# EAGLE design Tag-ECG-1V1 (EAGLE 9.6.2)

## Sheet 1 of 2
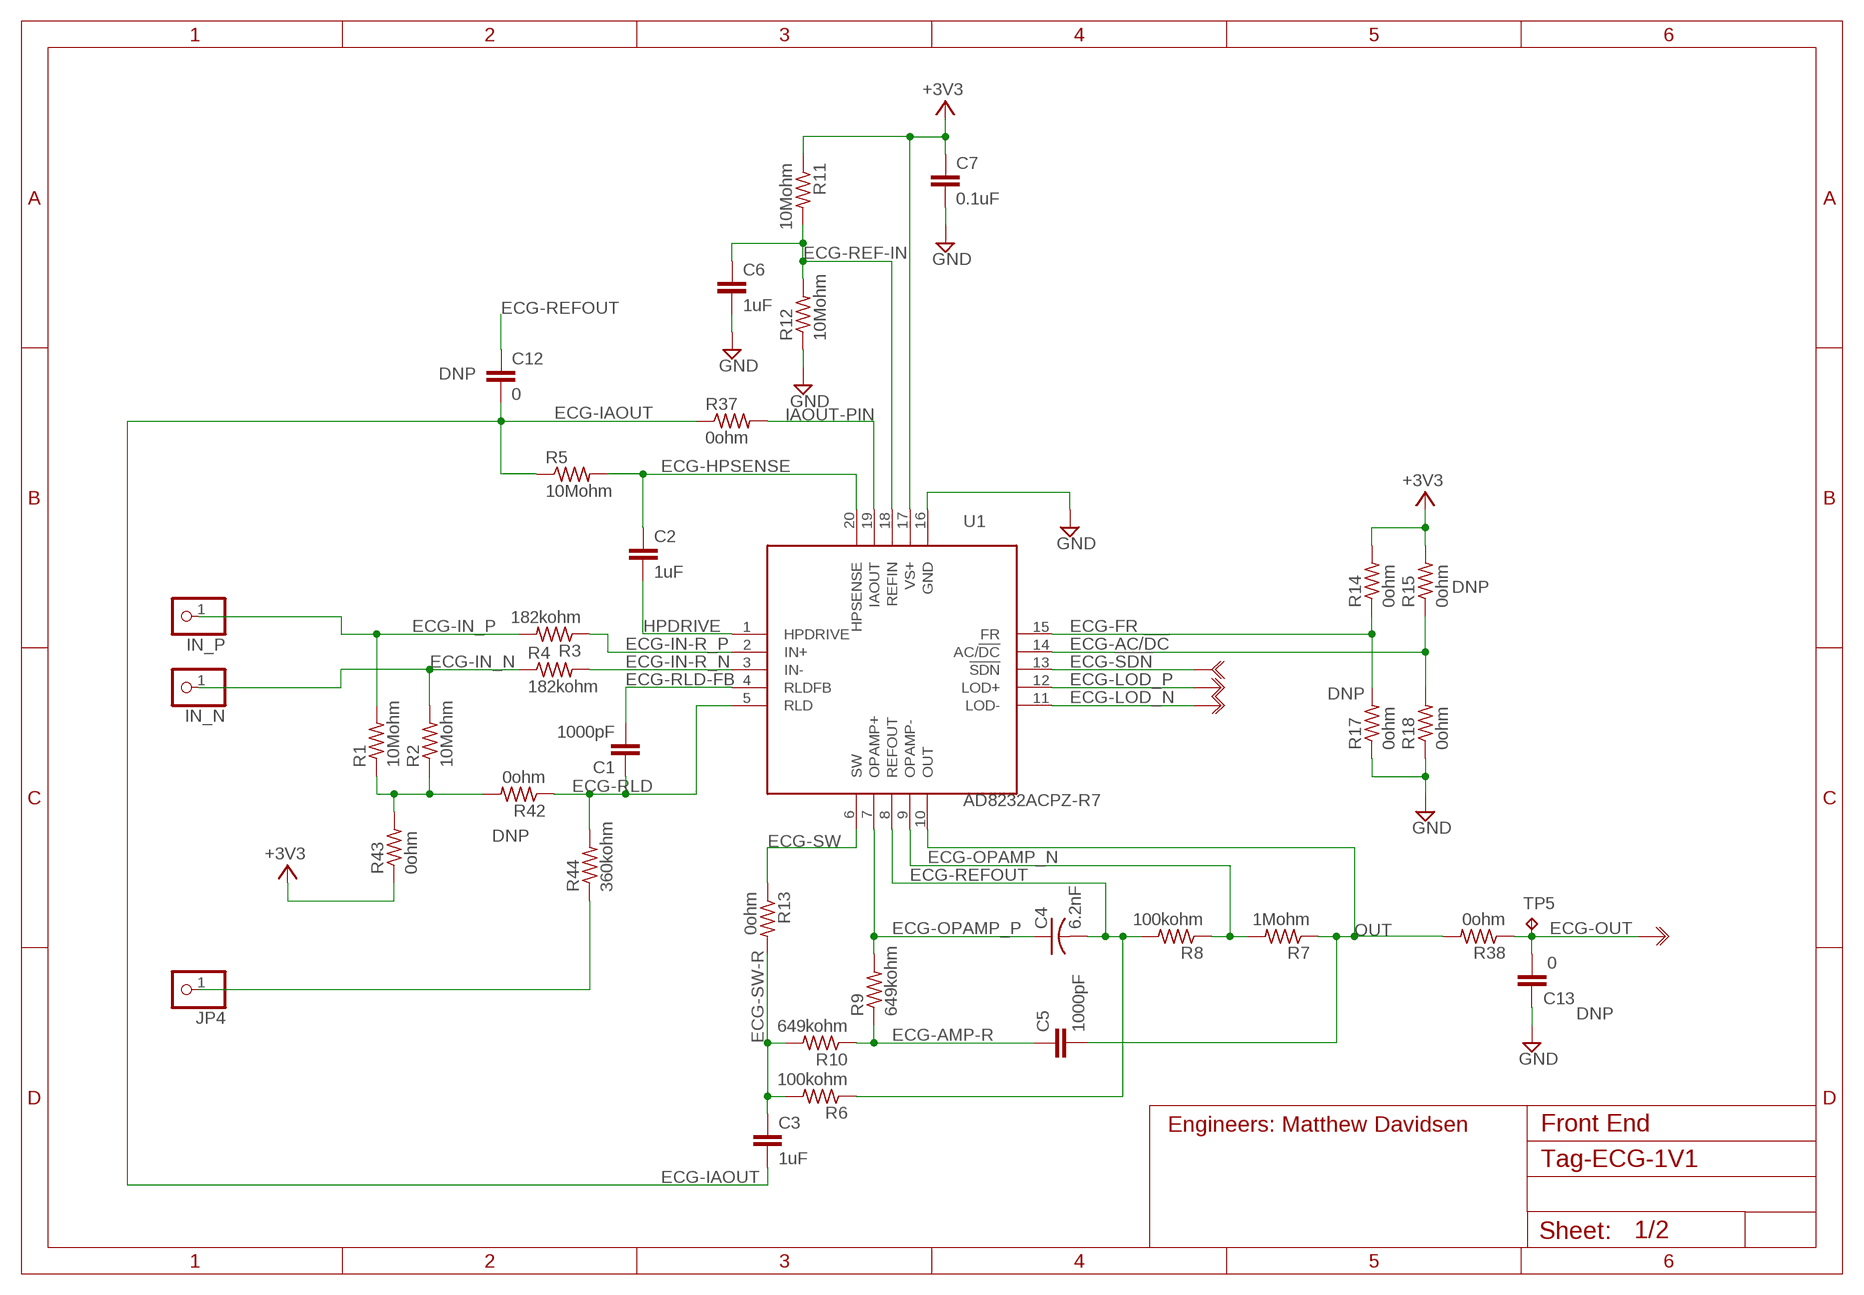
[diagram p0: schematic, sheet 1]
FRAME1 (A4L-LOC): NOTE: Engineers: Matthew Davidsen; SHEET_NAME: Front End

### Parts
C1  1000pF  CAP,CER,1000PF,2KV,10%,X7R,0402  [C0402]
C2  1uF  CAP,CER,1UF,10V,10%,X5R,0402  [C0402]
C3  1uF  CAP,CER,1UF,10V,10%,X5R,0402  [C0402]
C4  6.2nF  C-USC0603  [C0603]
C5  1000pF  CAP,CER,1000PF,2KV,10%,X7R,0402  [C0402]
C6  1uF  CAP,CER,1UF,10V,10%,X5R,0402  [C0402]
C7  0.1uF  CAP,CER,0.1UF,16V,10%,X5R,0402  [C0402]
C12  0  CAP,CER,1UF,10V,10%,X5R,0402  [C0402]
C13  0  CAP,CER,1000PF,2KV,10%,X7R,0402  [C0402]
IN_N  PINHD-1X1  [1X01]
IN_P  PINHD-1X1  [1X01]
JP4  PINHD-1X1  [1X01]
R1  10Mohm  RES,SMD,10MOHM,1%,1/10W,0402  [R0402]
R2  10Mohm  RES,SMD,10MOHM,1%,1/10W,0402  [R0402]
R3  182kohm  RES,SMD,182KOHM,1%,1/10W,0402  [R0402]
R4  182kohm  RES,SMD,182KOHM,1%,1/10W,0402  [R0402]
R5  10Mohm  RES,SMD,10MOHM,1%,1/10W,0402  [R0402]
R6  100kohm  RES,SMD,100KOHM,10%,1/10W,0402  [R0402]
R7  1Mohm  RES,SMD,1MOHM,1%,1/10W,0402  [R0402]
R8  100kohm  RES,SMD,100KOHM,10%,1/10W,0402  [R0402]
R9  649kohm  RES,SMD,649KOHM,1%,1/10W,0402  [R0402]
R10  649kohm  RES,SMD,649KOHM,1%,1/10W,0402  [R0402]
R11  10Mohm  RES,SMD,10MOHM,1%,1/10W,0402  [R0402]
R12  10Mohm  RES,SMD,10MOHM,1%,1/10W,0402  [R0402]
R13  0ohm  RES,SMD,1MOHM,1%,1/10W,0402  [R0402]
R14  0ohm  RES,SMD,0OHM,5%,1/16W,0402  [R0402]
R15  0ohm  RES,SMD,0OHM,5%,1/16W,0402  [R0402]
R17  0ohm  RES,SMD,0OHM,5%,1/16W,0402  [R0402]
R18  0ohm  RES,SMD,0OHM,5%,1/16W,0402  [R0402]
R37  0ohm  RES,SMD,10MOHM,1%,1/10W,0402  [R0402]
R38  0ohm  RES,SMD,1MOHM,1%,1/10W,0402  [R0402]
R42  0ohm  RES,SMD,0OHM,5%,1/16W,0402  [R0402]
R43  0ohm  RES,SMD,0OHM,5%,1/16W,0402  [R0402]
R44  360kohm  RES,SMD,0OHM,5%,1/16W,0402  [R0402]
TP5  TPB1,27  [B1,27]
U1  AD8232ACPZ-R7  [AD8232ACPZ-R7]
U$2  ON-PAGE  (no package)
U$5  OFF-PAGE  (no package)
U$6  OFF-PAGE  (no package)
U$39  OFF-PAGE  (no package)

### Nets
+3V3: C7.1 R11.1 R14.2 R15.2 R43.1 U1.17(VS+) ; also sheet 2
ECG-!SDN: U1.13(!SDN) U$2.IN ; also sheet 2
ECG-AC/!DC: R15.1 R18.2 U1.14(AC/!DC)
ECG-AMP-R: C5.1 R9.1 R10.1
ECG-FR: R14.1 R17.2 U1.15(FR)
ECG-HPSENSE: C2.1 R5.2 U1.20(HPSENSE)
ECG-IAOUT: C3.2 C12.2 R5.1 R37.1 ; also sheet 2
ECG-IN-R_N: R4.2 U1.3(IN-)
ECG-IN-R_P: R3.1 U1.2(IN+)
ECG-IN_N: IN_N.1 R2.2 R4.1 ; also sheet 2
ECG-IN_P: IN_P.1 R1.2 R3.2 ; also sheet 2
ECG-LOD_N: U1.11(LOD-) U$39.OUT ; also sheet 2
ECG-LOD_P: U1.12(LOD+) U$6.OUT ; also sheet 2
ECG-OPAMP_N: R7.2 R8.1 U1.9(OPAMP-)
ECG-OPAMP_P: C4.1 R9.2 U1.7(OPAMP+)
ECG-OUT: C13.2 R38.1 TP5.TP U$5.OUT ; also sheet 2
ECG-REF-IN: C6.1 R11.2 R12.2 U1.18(REFIN)
ECG-REFOUT: C4.2 C12.1 R6.1 R8.2 U1.8(REFOUT)
ECG-RLD: C1.1 R42.1 R44.2 U1.5(RLD) ; also sheet 2
ECG-RLD-FB: C1.2 U1.4(RLDFB)
ECG-SW: R13.1 U1.6(SW)
ECG-SW-R: C3.1 R6.2 R10.2 R13.2
GND: C6.2 C7.2 C13.1 R12.1 R17.1 R18.1 U1.16(GND) ; also sheet 2
HPDRIVE: C2.2 U1.1(HPDRIVE)
IAOUT-PIN: R37.2 U1.19(IAOUT)
N$2: R1.1 R2.1 R42.2 R43.2
N$4: JP4.1 R44.1
OUT: C5.2 R7.1 R38.2 U1.10(OUT)

### Notes on the sheet
- DNP
- DNP
- DNP
- DNP
- DNP

## Sheet 2 of 2
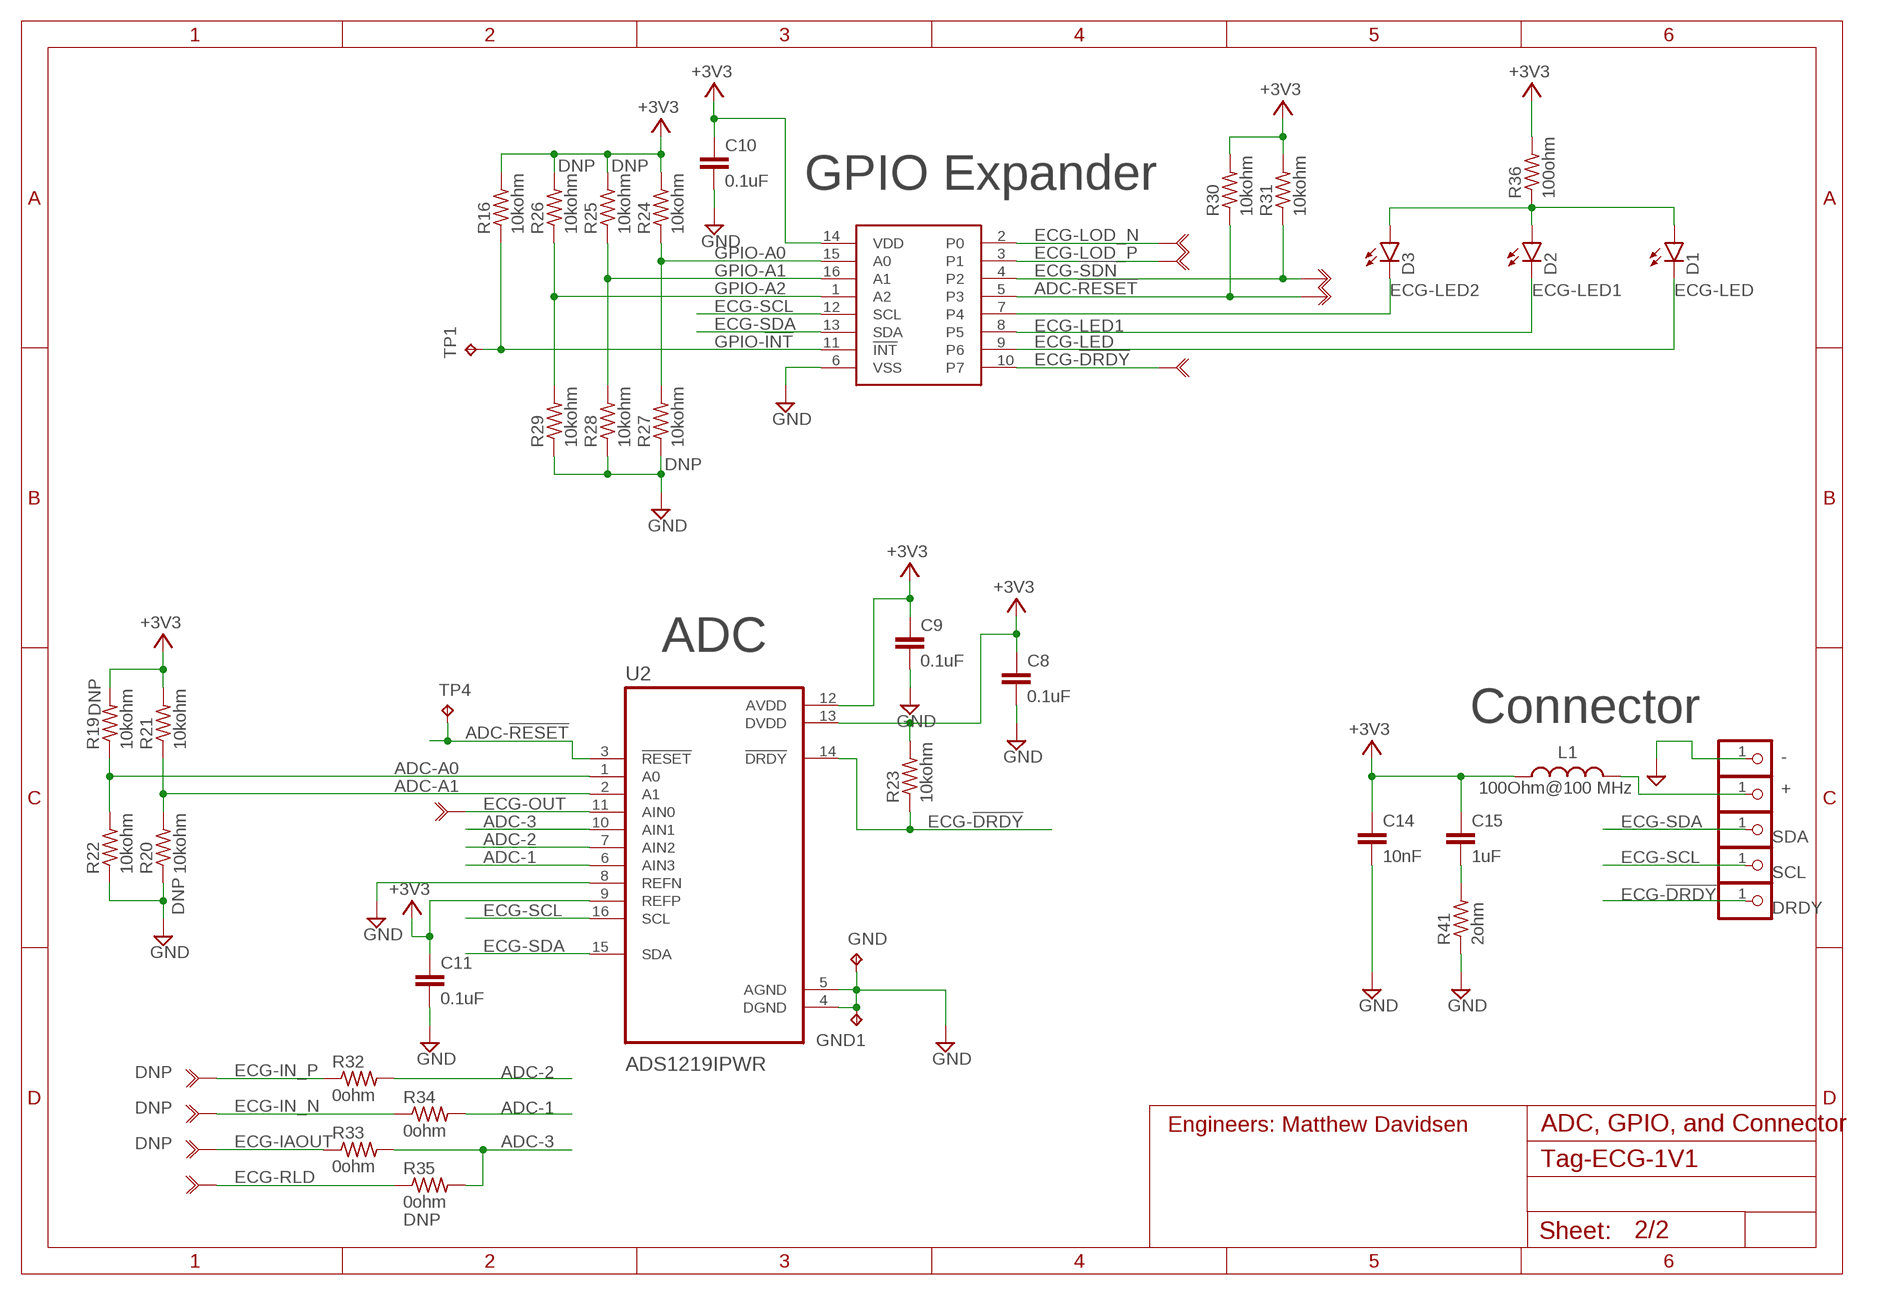
[diagram p1: schematic, sheet 2]
FRAME2 (A4L-LOC): NOTE: Engineers: Matthew Davidsen; SHEET_NAME: ADC, GPIO, and Connector

### Parts
+  PINHD-1X1  [1X01]
-  PINHD-1X1  [1X01]
C8  0.1uF  CAP,CER,0.1UF,16V,10%,X5R,0402  [C0402]
C9  0.1uF  CAP,CER,0.1UF,16V,10%,X5R,0402  [C0402]
C10  0.1uF  CAP,CER,0.1UF,16V,10%,X5R,0402  [C0402]
C11  0.1uF  CAP,CER,0.1UF,16V,10%,X5R,0402  [C0402]
C14  10nF  CAP,CER,0.1UF,16V,10%,X5R,0402  [C0402]
C15  1uF  CAP,CER,0.1UF,16V,10%,X5R,0402  [C0402]
D1  LED,SMD,GREEN,0603CHIP-LED0603  [CHIP-LED0603]
D2  LED,SMD,GREEN,0603CHIP-LED0603  [CHIP-LED0603]
D3  LED,SMD,GREEN,0603CHIP-LED0603  [CHIP-LED0603]
DRDY  PINHD-1X1  [1X01]
GND  TPB1,27  [B1,27]
GND1  TPB1,27  [B1,27]
L1  100Ohm@100 MHz  WE-CBF_0402_742792711_WB_HS  [WE-CBF_0402_W1.5]
R16  10kohm  RES,SMD,10KOHM,1%,1/16W,0402  [R0402]
R19  10kohm  RES,SMD,10KOHM,1%,1/16W,0402  [R0402]
R20  10kohm  RES,SMD,10KOHM,1%,1/16W,0402  [R0402]
R21  10kohm  RES,SMD,10KOHM,1%,1/16W,0402  [R0402]
R22  10kohm  RES,SMD,10KOHM,1%,1/16W,0402  [R0402]
R23  10kohm  RES,SMD,10KOHM,1%,1/16W,0402  [R0402]
R24  10kohm  RES,SMD,10KOHM,1%,1/16W,0402  [R0402]
R25  10kohm  RES,SMD,10KOHM,1%,1/16W,0402  [R0402]
R26  10kohm  RES,SMD,10KOHM,1%,1/16W,0402  [R0402]
R27  10kohm  RES,SMD,10KOHM,1%,1/16W,0402  [R0402]
R28  10kohm  RES,SMD,10KOHM,1%,1/16W,0402  [R0402]
R29  10kohm  RES,SMD,10KOHM,1%,1/16W,0402  [R0402]
R30  10kohm  RES,SMD,10KOHM,1%,1/16W,0402  [R0402]
R31  10kohm  RES,SMD,10KOHM,1%,1/16W,0402  [R0402]
R32  0ohm  RES,SMD,0OHM,5%,1/16W,0402  [R0402]
R33  0ohm  RES,SMD,0OHM,5%,1/16W,0402  [R0402]
R34  0ohm  RES,SMD,0OHM,5%,1/16W,0402  [R0402]
R35  0ohm  RES,SMD,0OHM,5%,1/16W,0402  [R0402]
R36  100ohm  RES,SMD,100OHM,5%,1/10W,0402  [R0402]
R41  2ohm  RES,SMD,10KOHM,1%,1/16W,0402  [R0402]
SCL  PINHD-1X1  [1X01]
SDA  PINHD-1X1  [1X01]
TP1  TPB1,27  [B1,27]
TP4  TPB1,27  [B1,27]
U2  ADS1219IPWR  [SOP65P640X120-16N]
U3  PCA9674ABS  [QFN3X3-6]
U$1  ON-PAGE  (no package)
U$3  ON-PAGE  (no package)
U$4  ON-PAGE  (no package)
U$7  OFF-PAGE  (no package)
U$21  ON-PAGE  (no package)
U$22  ON-PAGE  (no package)
U$24  ON-PAGE  (no package)
U$25  ON-PAGE  (no package)
U$35  OFF-PAGE  (no package)
U$40  ON-PAGE  (no package)

### Nets
+3V3: C8.1 C9.1 C10.1 C11.1 C14.1 C15.1 L1.1 R16.2 R19.2 R21.2 R23.2 R24.2 R25.2 R26.2 R30.2 R31.2 R36.2 U2.9(REFP) U2.12(AVDD) U2.13(DVDD) U3.14(VDD) ; also sheet 1
ADC-1: R34.2 U2.6(AIN3)
ADC-2: R32.2 U2.7(AIN2)
ADC-3: R33.2 R35.2 U2.10(AIN1)
ADC-!RESET: R30.1 TP4.TP U2.3(!RESET) U3.5(P3) U$7.OUT
ADC-A0: R19.1 R22.2 U2.1(A0)
ADC-A1: R20.2 R21.1 U2.2(A1)
ECG-!DRDY: DRDY.1 R23.1 U2.14(!DRDY) U3.10(P7) U$40.IN
ECG-!SDN: R31.1 U3.4(P2) U$35.OUT ; also sheet 1
ECG-IAOUT: R33.1 U$24.IN ; also sheet 1
ECG-IN_N: R34.1 U$25.IN ; also sheet 1
ECG-IN_P: R32.1 U$4.IN ; also sheet 1
ECG-LED: D1.C U3.9(P6)
ECG-LED1: D2.C U3.8(P5)
ECG-LED2: D3.C U3.7(P4)
ECG-LOD_N: U3.2(P0) U$1.IN ; also sheet 1
ECG-LOD_P: U3.3(P1) U$22.IN ; also sheet 1
ECG-OUT: U2.11(AIN0) U$21.IN ; also sheet 1
ECG-RLD: R35.1 U$3.IN ; also sheet 1
ECG-SCL: SCL.1 U2.16(SCL) U3.12(SCL)
ECG-SDA: SDA.1 U2.15(SDA) U3.13(SDA)
GND: -.1 C8.2 C9.2 C10.2 C11.2 C14.2 GND1.TP GND.TP R20.1 R22.1 R27.1 R28.1 R29.1 R41.1 U2.4(DGND) U2.5(AGND) U2.8(REFN) U3.6(VSS) ; also sheet 1
GPIO-!INT: R16.1 TP1.TP U3.11(!INT)
GPIO-A0: R24.1 R27.2 U3.15(A0)
GPIO-A1: R25.1 R28.2 U3.16(A1)
GPIO-A2: R26.1 R29.2 U3.1(A2)
N$1: +.1 L1.2
N$3: C15.2 R41.2
N$7: D1.A D2.A D3.A R36.1

### Notes on the sheet
- DNP | DNP
- GPIO Expander
- DNP
- ADC
- DNP
- Connector
- DNP
- DNP
- DNP
- DNP
- DNP

## Library data of the parts
+ - DRDY IN_N IN_P JP4 SCL SDA = pinhead:PINHD-1X1: PIN HEADER
C1 C5 = 0-Standard-Passives:CAP,CER,1000PF,2KV,10%,X7R,0402
C2 C3 C6 = 0-Standard-Passives:CAP,CER,1UF,10V,10%,X5R,0402
C4 = rcl:C-US: CAPACITOR, American symbol; SPICEPREFIX: C
C7-C11 = 0-Standard-Passives:CAP,CER,0.1UF,16V,10%,X5R,0402
C12 = 0-Standard-Passives:CAP,CER,1UF,10V,10%,X5R,0402; VALUE: 1uF
C13 = 0-Standard-Passives:CAP,CER,1000PF,2KV,10%,X7R,0402; VALUE: 1000pF
C14 C15 = 0-Standard-Passives:CAP,CER,0.1UF,16V,10%,X5R,0402; VALUE: 0.1uF
D1-D3 = 0-Custom-Opto:LED,SMD,GREEN,0603
GND GND1 TP1 TP4 TP5 = testpad:TP: Test pad
L1 = Wurth_EMC Components_WE-CBF:WE-CBF_0402: WE-CBF SMD EMI Suppression Ferrite Bead Characteristics Reliable Ni-Sn electrodes High rated current up to 6 A Operating temperature: –55 ºC to +125 ºC Applications Perfect as data lined filter and for uncoupling of distribution voltage Package name and Variant abbreviation: Package: Wide Band /High Speed: W=Width= 1.5 High Current: W=Width= 2.2 Variant abbreviation: WB = Wide Band HS=High Speed HC=High Current <https://www.we-online.com/catalog/media/o14753v209%20Family_WE-CBF.jpg> Details see: www.we-online.com/katalog/WE-CBF <www.we-online.com/catalog/WE-CBF/?utm_source=eagle_model&utm_medium=description_link&utm_campaign=eisos_eagle> Updated by Ella Wu 2022-11-02 2022(C) Wurth Elektronik; DATASHEET-URL: https://www.we-online.com/redexpert/spec/742792711?ae; IR2: 870mA; MOUNT: SMT; PART-NUMBER: 742792711; RDC-MAX: 0.3Ohm; TYPE: High Speed; Z-MAX: 200Ohm@800 MHz
R1 R2 R5 R11 R12 = 0-Standard-Passives:RES,SMD,10MOHM,1%,1/10W,0402
R3 R4 = 0-Standard-Passives:RES,SMD,182KOHM,1%,1/10W,0402
R6 R8 = 0-Standard-Passives:RES,SMD,100KOHM,10%,1/10W,0402
R7 = 0-Standard-Passives:RES,SMD,1MOHM,1%,1/10W,0402
R9 R10 = 0-Standard-Passives:RES,SMD,649KOHM,1%,1/10W,0402
R13 R38 = 0-Standard-Passives:RES,SMD,1MOHM,1%,1/10W,0402; VALUE: 1Mohm
R14 R15 R17 R18 R32-R35 R42 R43 = 0-Standard-Passives:RES,SMD,0OHM,5%,1/16W,0402
R16 R19-R31 = 0-Standard-Passives:RES,SMD,10KOHM,1%,1/16W,0402
R36 = 0-Standard-Passives:RES,SMD,100OHM,5%,1/10W,0402
R37 = 0-Standard-Passives:RES,SMD,10MOHM,1%,1/10W,0402; VALUE: 10Mohm
R41 = 0-Standard-Passives:RES,SMD,10KOHM,1%,1/16W,0402; VALUE: 10kohm
R44 = 0-Standard-Passives:RES,SMD,0OHM,5%,1/16W,0402; VALUE: 0ohm
U1 = AD8232ACPZ-R7:AD8232ACPZ-R7
U2 = ADS1219IPWR:ADS1219IPWR; DESCRIPTION: 24-bit, 1kSPS, 4-ch general-purpose delta-sigma ADC with I2C interface and external Vref inputs; DIGI-KEY_PART_NUMBER: 296-50884-2-ND; MF: Texas Instruments; MP: ADS1219IPWR; PACKAGE: TSSOP-16 Texas Instruments; PURCHASE-URL: https://pricing.snapeda.com/search/part/ADS1219IPWR/?ref=eda
U3 = untitled:PCA9674ABS
U$1-U$4 U$21 U$22 U$24 U$25 U$40 = 0-Custom-Markers:ON-PAGE
U$5-U$7 U$35 U$39 = 0-Custom-Markers:OFF-PAGE

## Board
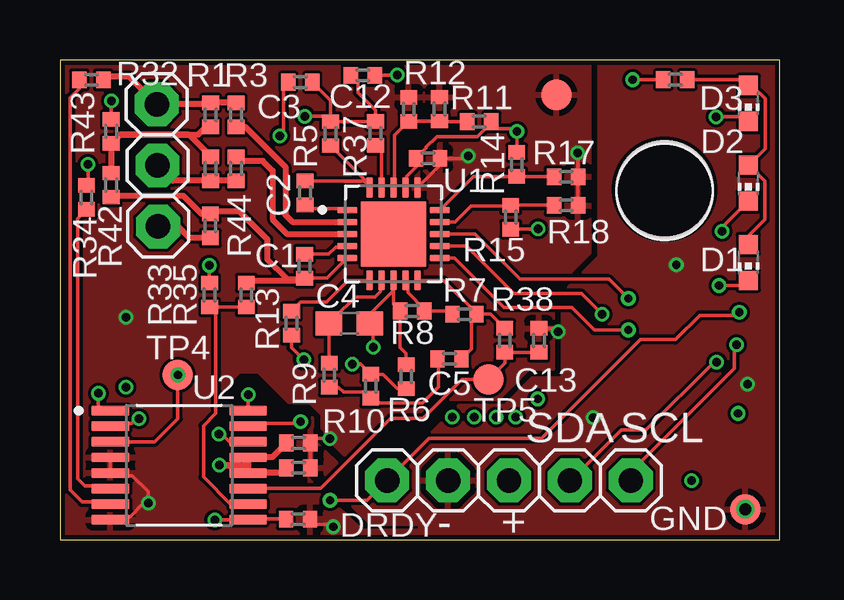
[diagram p2: board, top side]
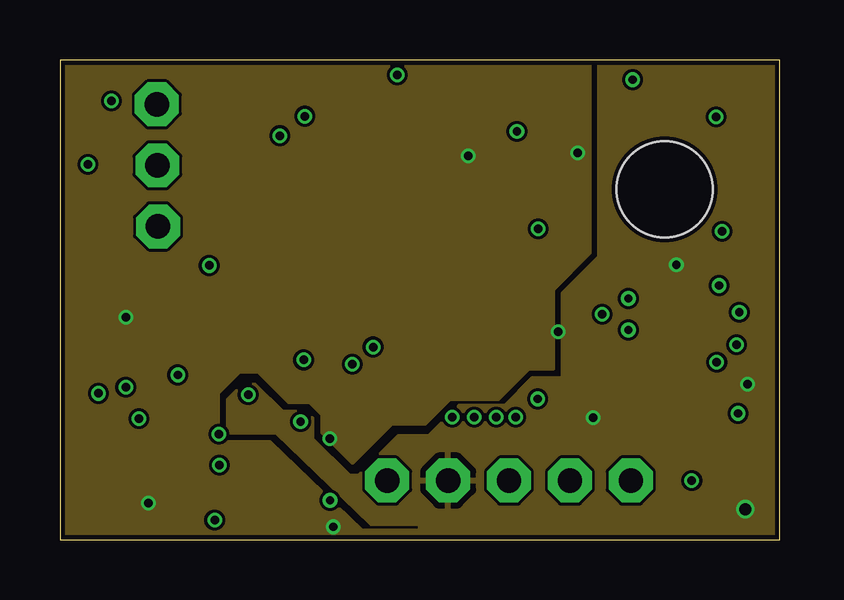
[diagram p3: board, inner layer Route2]
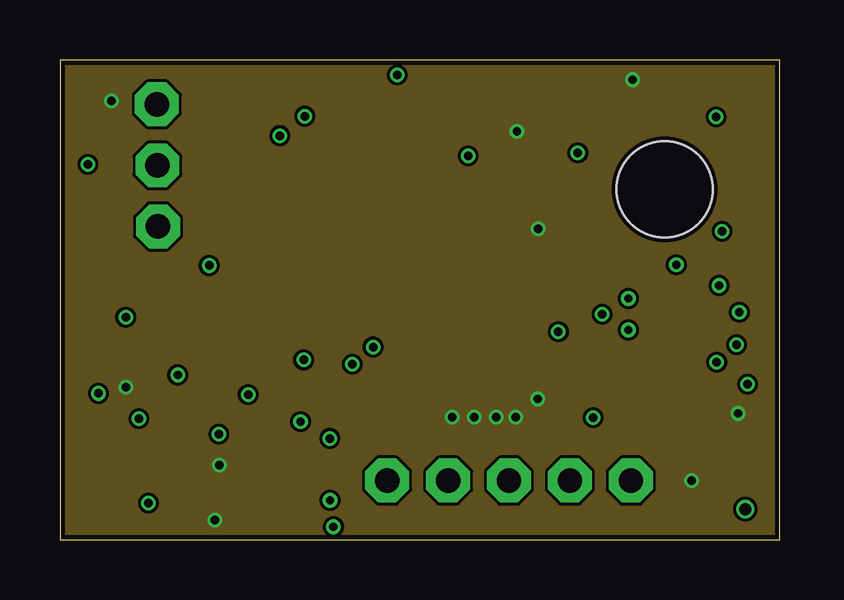
[diagram p4: board, inner layer Route15]
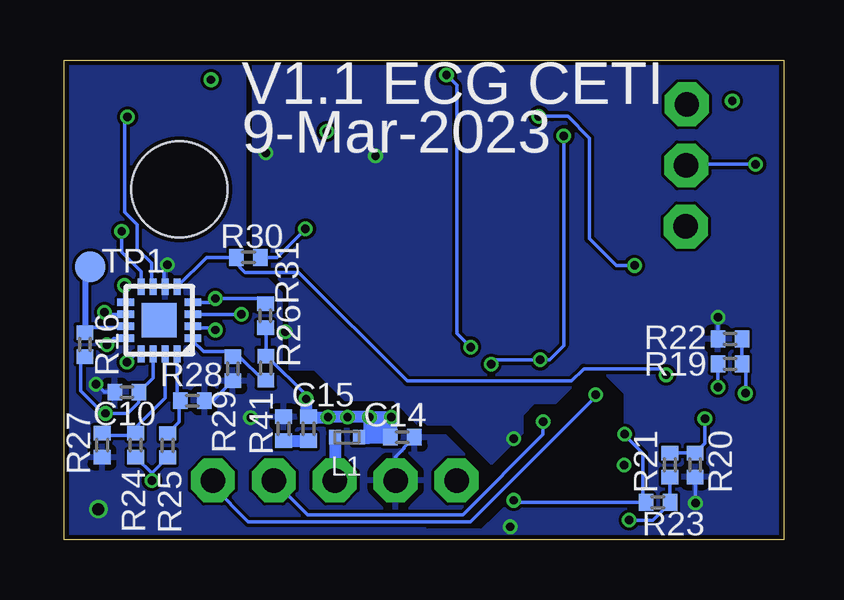
[diagram p5: board, bottom side, seen from below]

Size 30 x 20 mm. Coordinates in mm from the lower left corner, seen from the top.
Outline: 0,0 30,0 30,20 0,20 0,0
Copper layers (1+2*15+16): Top 0.035mm / dielectric 0.2mm / Route2 0.0175mm / dielectric 1.065mm / Route15 0.0175mm / dielectric 0.2mm / Bottom 0.035mm
Design rules "default *": minimum track width 3.5mil, minimum drill 0.3mm, track to track 5mil, track to pad 0.2mm, pad to pad 5mil, via to via 0.5mm, smd to smd 5mil, copper to edge 0.2mm, drill to drill 6mil, minimum pad ring 10mil, minimum via ring 0.13mm, stop-mask expansion 0.05mm, vias tented up to drill 20mil, thermal gap 10mil
Holes 4 mm at 25.2,14.6

### Footprints (pad centres in the part's own frame; a part is rotated, then mirrored left to right if it is on the bottom)
1X01 = drill 1.016 octagon: 1 0,0
C0402 = smd 0.6 x 0.7: 1 -0.5,0; 2 0.5,0
C0603 = smd 1.1 x 1: 1 -0.85,0; 2 0.85,0
CHIP-LED0603 = smd 0.8 x 0.8: A 0,-0.75; C 0,0.75
B1,27 = smd 1.27 x 1.27: TP 0,0
WE-CBF_0402_W1.5 = smd 0.5 x 0.6: 1 -0.5,0; 2 0.5,0
R0402 = smd 0.6 x 0.7: 1 -0.5,0; 2 0.5,0
AD8232ACPZ-R7 = smd 0.84 x 0.26: 1 -1.935,1; 2 -1.935,0.5; 3 -1.935,0; 4 -1.935,-0.5; 5 -1.935,-1; 11 1.935,-1; 12 1.935,-0.5; 13 1.935,0; 14 1.935,0.5; 15 1.935,1 | smd 0.26 x 0.84: 6 -1,-1.935; 7 -0.5,-1.935; 8 0,-1.935; 9 0.5,-1.935; 10 1,-1.935; 16 1,1.935; 17 0.5,1.935; 18 0,1.935; 19 -0.5,1.935; 20 -1,1.935 | smd 2.7 x 2.7: 21 0,0
SOP65P640X120-16N = smd 1.57 x 0.41: 1 -2.87,2.275; 2 -2.87,1.625; 3 -2.87,0.975; 4 -2.87,0.325; 5 -2.87,-0.325; 6 -2.87,-0.975; 7 -2.87,-1.625; 8 -2.87,-2.275; 9 2.87,-2.275; 10 2.87,-1.625; 11 2.87,-0.975; 12 2.87,-0.325; 13 2.87,0.325; 14 2.87,0.975; 15 2.87,1.625; 16 2.87,2.275
QFN3X3-6 = smd 0.7 x 0.3: 1 -1.4,0.75; 2 -1.4,0.25; 3 -1.4,-0.25; 4 -1.4,-0.75; 9 1.4,-0.75; 10 1.4,-0.25; 11 1.4,0.25; 12 1.4,0.75 | smd 0.3 x 0.7: 5 -0.75,-1.4; 6 -0.25,-1.4; 7 0.25,-1.4; 8 0.75,-1.4; 13 0.75,1.4; 14 0.25,1.4; 15 -0.25,1.4; 16 -0.75,1.4 | smd 1.45 x 1.45: EXP 0,0

### Placement (x,y rotation side)
+  18.72,2.46 0 top
-  16.18,2.46 0 top
C1  10.2,11.4 90 top
C2  10.22,14.46 270 top
C3  10.02,19.07 0 top
C4  12.06,9.02 0 top
C5  16.24,7.54 0 top
C6  14.54,17.94 90 top
C7  15.34,15.89 0 top
C8  9.94,3 0 top
C9  9.94,4.03 0 top
C10  27.39,6.15 180 bottom
C11  9.93,0.86 0 top
C12  12.62,19.35 180 top
C13  19.96,8.31 270 top
C14  15.9,4.27 0 bottom
C15  19.81,4.62 270 bottom
D1  28.7,11.56 180 top
D2  28.7,14.86 180 top
D3  28.7,18.19 180 top
DRDY  13.64,2.46 0 top
GND  28.57,1.27 0 top
GND1  20.7,18.54 0 top
IN_N  4.06,15.61 0 top
IN_P  4.04,18.15 0 top
JP4  4.09,13.06 0 top
L1  18.21,4.27 180 bottom
R1  6.28,17.71 90 top
R2  6.28,15.46 270 top
R3  7.35,17.71 90 top
R4  7.34,15.46 90 top
R5  11.29,16.93 270 top
R6  14.44,6.8 270 top
R7  16.86,9.4 180 top
R8  14.68,9.53 180 top
R9  11.23,6.85 90 top
R10  12.96,6.39 90 top
R11  17.48,17.43 180 top
R12  15.82,17.95 270 top
R13  9.65,9.02 270 top
R14  19.04,15.64 90 top
R15  18.79,13.44 270 top
R16  29.13,8.13 270 bottom
R17  21.1,15.13 180 top
R18  21.1,13.93 180 top
R19  2.24,7.33 180 bottom
R20  3.7,3.11 90 bottom
R21  4.75,3.11 270 bottom
R22  2.24,8.36 0 bottom
R23  5.25,1.55 0 bottom
R24  27.02,3.94 270 bottom
R25  25.68,3.93 270 bottom
R26  21.59,7.15 90 bottom
R27  28.42,3.94 90 bottom
R28  24.65,5.79 180 bottom
R29  22.97,7.12 90 bottom
R30  22.31,11.77 0 bottom
R31  21.61,9.33 270 bottom
R32  1.31,19.17 180 top
R33  6.24,10.2 270 top
R34  1.11,14.26 270 top
R35  7.77,10.2 270 top
R36  25.65,19.18 180 top
R37  13.16,16.94 270 top
R38  18.54,8.31 90 top
R41  20.85,4.62 270 bottom
R42  2.13,14.78 90 top
R43  2.13,17.02 270 top
R44  6.27,13.08 90 top
SCL  23.8,2.46 0 top
SDA  21.26,2.46 0 top
TP1  28.91,11.38 180 bottom
TP4  4.91,6.86 180 top
TP5  17.86,6.68 0 top
U1  13.91,12.74 0 top
U2  4.97,3.1 0 top
U3  26.04,9.14 180 bottom

### Tracks (layer width: path | path; a pad name or v marks a point on that pad's centre or on a via)
+3V3  (via drill 0.35)
  Top 0.152: U1.17 14.45,14.72 14.45,15.14 14.84,15.54 C7.1 15.27,16.32 15.27,16.36 15.71,16.8 17.4,16.8 17.92,17.32 18.09,17.32 | v6.45,0.81 6.47,0.83 U2.9 7.87,0.86 C11.1 | R36.2 v23.88,19.18 | R14.2 v19.04,17.01 v19.05,17.02 18.92,17.14 18.27,17.14 18.09,17.32 | R11.1 18.09,17.32 | R15.2 v19.93,12.95 v19.94,12.95 | R43.1 2.14,17.53 v2.14,18.29
  Top 0.254: C8.1 9.23,2.78 U2.12 | C9.1 8.84,3.43 U2.13 | U2.13 U2.12 | U2.12 7.51,3.1 v6.65,3.1 7.64,3.1 7.84,3.3 U2.13
  Bottom 0.152: U3.14 26.29,6.75 C10.1 26.89,5.72 27.35,5.27 v28.27,5.27 v28.27,5.26 28.38,5.26 29.31,6.19 29.31,7.45 R16.2 | v6.45,0.81 5.45,0.81 4.92,1.34 4.92,1.39 R23.2 | R23.2 | R21.2 R23.2 | R25.2 26.34,2.77 v26.34,2.46 26.34,2.76 R24.2 | 19.8,5.11 C15.1 | v2.74,6.35 R19.2 | R30.2 21.13,11.77 v19.94,12.95 | 17.32,4.23 17.27,4.28 | v19.91,5.87 19.91,6.03 21.49,7.6 21.54,7.6 R26.2 21.59,8.81 R31.2
  Bottom 0.508: 17.27,4.28 v17.27,5.11 | 17.32,4.23 16.43,4.23 C14.1 16.36,4.31 v16.36,5.11 | v19.91,5.87 19.91,5.22 C15.1 19.79,5.1 19.01,5.1 v19,5.11 v18.19,5.11 v17.27,5.11 | v17.27,5.11 v16.36,5.11 | v16.36,5.11 16.48,5.11 17.36,4.23 17.68,4.23 L1.1 | v17.27,5.11 16.4,4.23
  pour Route15: 0,20 0,0 30,0 30,20
ADC-1
  Top 0.152: U2.6 2,2.23 1.03,2.23 0.73,2.52 0.73,13.39 R34.2
ADC-2
  Top 0.152: U2.7 2.01,1.57 0.93,1.57 0.43,2.06 0.43,18.42 0.81,18.8 R32.2
ADC-3
  Top 0.152: U2.10 7.12,1.48 5.99,2.61 5.99,4.75 6.5,5.25 6.5,9.44 R33.2 R35.2
ADC-!RESET  (via drill 0.35)
  Top 0.152: U2.3 3.95,4.08 4.91,5.04 TP4.TP
  Bottom 0.152: U3.5 24.06,11.77 R30.1 22.94,11.64 22.94,11.63 22.45,11.14 20.22,11.14 15.69,6.61 8.85,6.61 8.34,7.12 5.16,7.12 TP4.TP
  other vias: 4.91,6.86
ADC-A0  (via drill 0.35)
  Top 0.152: v1.6,6.1 1.6,5.6 1.87,5.33 2.05,5.33 U2.1
  Bottom 0.152: v1.6,6.1 1.59,6.11 1.59,7.17 R19.1 R22.2
ADC-A1  (via drill 0.35)
  Top 0.152: U2.2 2.22,4.85 2.99,4.85 3.19,5.04 v3.29,5.04
  Bottom 0.152: R21.1 R20.2 3.29,4.02 v3.29,5.04
ECG-!DRDY  (via drill 0.35)
  Top 0.152: U2.14 7.08,4.08 6.82,4.33 6.69,4.33 v6.63,4.39 | v11.26,1.63 12.81,1.63 DRDY.1 15.39,4.22 20.07,4.22 24.19,8.34 25.65,8.34 26.67,9.35 28.19,9.35 v28.32,9.48
  Bottom 0.152: v6.63,4.39 6.63,4.34 5.87,3.59 5.87,1.68 R23.1 11.18,1.55 v11.26,1.63 | U3.10 28.24,9.39 v28.32,9.48
ECG-!SDN  (via drill 0.35)
  Top 0.152: v23.7,10.05 22.89,10.86 19.18,10.86 17.3,12.74 U1.13
  Bottom 0.152: U3.4 23.86,9.89 v23.7,10.05 21.83,10.05 R31.1
ECG-AC/!DC
  Top 0.152: U1.14 16.47,13.24 17.14,13.91 18.76,13.91 R15.1 20.59,13.95 R18.2
ECG-AMP-R
  Top 0.152: R9.1 11.61,6.35 11.82,6.15 12.71,6.15 R10.1 13.16,5.69 15.12,5.69 15.79,6.36 15.79,7.49 C5.1
ECG-FR
  Top 0.152: U1.15 17.24,15.14 R14.1 19.06,15.13 R17.2
ECG-HPSENSE
  Top 0.152: R5.2 12.91,14.81 12.91,14.73 | 12.91,14.73 U1.20 | C2.1 12.68,14.96 12.91,14.73
ECG-IAOUT  (via drill 0.35)
  Top 0.152: R5.1 11.29,18.31 C3.2 | C12.2 12.42,19.06 12.42,18.64 13.16,17.9 R37.1 13.14,17.43 R5.1 | R33.1 6.22,10.72 v6.22,11.43 | v10.21,17.65 11.06,17.65 R5.1
  Bottom 0.152: v6.22,11.43 6.99,11.43 8.1,12.55 8.1,16.75 9.01,17.65 9.66,17.65 | 9.66,17.65 | 9.66,17.65 v10.21,17.65
ECG-IN-R_N
  Top 0.254: U1.3 9.47,12.74 8.87,13.35 8.87,15.37 8.45,15.79 7.52,15.79 R4.2
ECG-IN-R_P
  Top 0.254: R3.1 7.73,17.21 9.4,15.54 9.4,13.54 9.69,13.24 U1.2
ECG-IN_N  (via drill 0.35)
  Top 0.152: v1.17,15.65 1.17,14.76 R34.1 | R2.2
  Top 0.254: IN_N.1 4.71,14.96 R2.2 R4.1
  Bottom 0.152: IN_N.1 4.02,15.65 v1.17,15.65
ECG-IN_P
  Top 0.254: R3.2 R1.2 6.23,18.16 IN_P.1 2.89,19.3 1.94,19.3 R32.1
ECG-LED  (via drill 0.35)
  Top 0.152: D1.C 28.49,10.59 v27.48,10.59
  Bottom 0.152: U3.9 27.48,9.94 v27.48,10.59
ECG-LED1  (via drill 0.35)
  Top 0.152: D2.C 27.6,13.01 v27.6,12.85
  Bottom 0.152: U3.8 26.79,11.18 27.6,11.99 v27.6,12.85
ECG-LED2  (via drill 0.35)
  Top 0.152: D3.C 28.51,17.63 v27.36,17.63
  Bottom 0.152: U3.7 26.36,10.62 26.36,11.52 26.95,12.11 26.95,13.13 27.48,13.66 27.48,17.5 v27.36,17.63
ECG-LOD_N  (via drill 0.35)
  Top 0.152: v23.7,8.74 22.28,8.74 21.34,9.68 18.52,9.68 16.45,11.74 U1.11
  Bottom 0.152: U3.2 24.56,8.82 23.84,8.82 23.76,8.74 v23.7,8.74
ECG-LOD_P  (via drill 0.35)
  Top 0.152: U1.12 16.94,12.24 18.92,10.26 21.74,10.26 v22.61,9.4 v22.61,9.39
  Bottom 0.152: U3.3 v22.61,9.39
ECG-OPAMP_N
  Top 0.152: U1.9 14.5,10.71 14.5,10.29 15.18,9.61 R8.1 16.23,9.53 R7.2
ECG-OPAMP_P
  Top 0.152: U1.7 13.38,10.81 13.36,10.83 13.36,10.34 13.13,10.11 12.31,10.11 11.45,9.25 11.45,9.02 C4.1 11.21,7.36 R9.2
ECG-OUT
  Top 0.152: U2.11 7.97,2 8.11,2.14 10.86,2.14 13.78,5.06 15.14,5.06 16.76,6.68 TP5.TP 18.54,7.37 R38.1 C13.2
ECG-REF-IN
  Top 0.152: R11.2 15.84,17.43 R12.2 C6.1 13.96,16.86 13.96,14.73 U1.18
ECG-REFOUT  (via drill 0.35)
  Top 0.152: R6.1 14.44,7.75 14.18,8.01 R8.2 13.91,9.81 U1.8 13.91,10.39 12.91,9.39 C4.2 13.06,8.88 v13.06,8.03 | v14.06,19.38 14.03,19.36 C12.1
  Bottom 0.152: v13.06,8.03 13.63,8.6 13.63,18.95 v14.06,19.38
ECG-RLD
  Top 0.152: 5.9,13.58 R44.2 6.38,13.69 | R42.1 2.18,14.33 | U1.5 11.13,10.9 C1.1 9.42,10.9
  Top 0.254: 5.9,13.58 5.16,14.33 2.18,14.33 | 6.38,13.69 7.47,13.69 8.64,12.52 8.64,11.68 9.42,10.9 | R35.1 7.84,10.77 10.07,10.77 C1.1
ECG-RLD-FB
  Top 0.152: U1.4 11.93,12.2 11.51,12.2 11.21,11.9 C1.2
ECG-SCL  (via drill 0.35)
  Top 0.152: v28.21,8.13 28.11,8.03 28.11,7.13 23.8,2.82 SCL.1 | v7.85,6.04 7.84,6.04 U2.16
  Bottom 0.152: U3.12 27.95,8.39 v28.21,8.13 | SCL.1 23.8,2.21 22.33,0.74 13.06,0.74 7.85,5.94 v7.85,6.04
ECG-SDA  (via drill 0.35)
  Top 0.152: v27.38,7.39 27.25,7.39 24.43,4.57 23.41,4.57 21.31,2.46 SDA.1 | v10.03,4.92 10.03,4.84 7.96,4.84 U2.15
  Bottom 0.152: U3.13 27.03,7.74 v27.38,7.39 | v10.03,4.92 10.03,4.39 13.38,1.04 19.84,1.04 SDA.1
ECG-SW
  Top 0.152: U1.6 12.02,10.81 11.12,9.91 10.04,9.91 R13.1
ECG-SW-R  (via drill 0.35)
  Top 0.152: R13.2 9.65,8 v10.16,7.49 | v9.17,16.84 9.32,16.99 9.32,18.87 C3.1 | v12.19,7.32 12.54,7.32 R10.2 13.46,6.89 14.05,6.3 R6.2
  Bottom 0.152: v9.17,16.84 9.17,8.1 9.78,7.49 v10.16,7.49 12.01,7.49 v12.19,7.32
GND  (via drill 0.35, 0.5)
  Top 0.152: U2.4 U2.5 2.22,2.66 3.02,2.66 3.67,2.01 3.67,1.54 v3.68,1.52 3.5,1.52 2.92,0.95 2.22,0.95 U2.8 | C8.2 C9.2 10.63,4.21 v11.25,4.21 | U1.16 15.84,15.62 C7.2 16.91,15.89 v17.02,16 | R18.1 R17.1 v21.6,16.12 v21.59,16.13 | v20.78,8.66 20.63,8.81 C13.1 | C11.2 10.65,0.63 11.3,0.63 v11.4,0.53
  Bottom 0.152: R20.1 3.7,1.54 v3.68,1.52 | R28.1 23.8,5.79 R29.1 | v25.7,11.46 25.82,11.33 25.82,10.58 U3.6 | C10.2 28.34,6.15 v28.67,6.48 | v2.74,9.27 R22.1 | C14.2 15.82,3.84 15.82,3.8 16.18,3.45 -.1
  other vias: 22.23,5.08 28.57,1.27
  pour Route2: 22.1,20.07 0,20.07 0,0 29.97,0 29.97,20.07 22.48,20.07 22.48,11.81 20.95,10.29 20.95,6.73 19.68,6.73 18.54,5.59 16.64,5.59 15.37,4.32 14.1,4.32 12.45,2.67 12.06,2.67 10.54,4.19 10.54,5.08 10.29,5.33 9.27,5.33 8.13,6.48 7.62,6.48 6.99,5.84 6.99,4.45 9.02,4.45 12.96,0.64 14.99,0.64 14.99,0.38 12.59,0.38 8.76,4.06 6.6,4.06 6.6,6.1 7.49,6.99 8.26,6.99 9.53,5.71 10.41,5.71 10.92,5.21 10.92,4.45 12.19,3.17 13.84,4.83 15.24,4.83 16.26,5.84 18.29,5.84 19.56,7.11 20.57,7.11 20.57,10.41 22.1,11.94
  pour Top: 22.1,20.07 0,20.07 0,0 29.97,0 29.97,20.07 22.48,20.07 22.48,11.81 20.95,10.29 20.95,6.73 19.68,6.73 18.54,5.59 16.64,5.59 15.37,4.32 14.1,4.32 12.45,2.67 12.06,2.67 10.54,4.19 10.54,5.08 10.29,5.33 9.27,5.33 8.13,6.48 7.62,6.48 6.99,5.84 6.99,4.45 9.02,4.45 12.96,0.64 14.99,0.64 14.99,0.38 12.59,0.38 8.76,4.06 6.6,4.06 6.6,6.1 7.49,6.99 8.26,6.99 9.53,5.71 10.41,5.71 10.92,5.21 10.92,4.45 12.19,3.17 13.84,4.83 15.24,4.83 16.26,5.84 18.29,5.84 19.56,7.11 20.57,7.11 20.57,10.41 22.1,11.94
  pour Bottom: 22.1,20.07 0,20.07 0,0 29.97,0 29.97,20.07 22.48,20.07 22.48,11.81 20.95,10.29 20.95,6.73 19.68,6.73 18.54,5.59 16.64,5.59 15.37,4.32 14.1,4.32 12.45,2.67 12.06,2.67 10.54,4.19 10.54,5.08 10.29,5.33 9.27,5.33 8.13,6.48 7.62,6.48 6.99,5.84 6.99,4.45 9.02,4.45 12.96,0.64 14.99,0.64 14.99,0.38 12.59,0.38 8.76,4.06 6.6,4.06 6.6,6.1 7.49,6.99 8.26,6.99 9.53,5.71 10.41,5.71 10.92,5.21 10.92,4.45 12.19,3.17 13.84,4.83 15.24,4.83 16.26,5.84 18.29,5.84 19.56,7.11 20.57,7.11 20.57,10.41 22.1,11.94
GPIO-!INT
  Bottom 0.152: U3.11 27.49,8.84 28.92,8.84 R16.1
  Bottom 0.254: TP1.TP 29.13,11.15 R16.1
GPIO-A0
  Bottom 0.152: U3.15 25.79,5.91 27.02,4.68 R24.1 27.12,4.33 28.32,4.33 R27.2
GPIO-A1
  Bottom 0.152: U3.16 25.29,6.12 25.15,6 R28.2 25.2,5.74 25.2,4.91 R25.1
GPIO-A2
  Bottom 0.152: U3.1 24.64,8.28 24.19,7.84 23.19,7.84 R29.2 22.69,7.62 21.72,6.65 R26.1
HPDRIVE
  Top 0.152: C2.2 10.4,13.96 10.55,13.8 11.91,13.8 U1.1
IAOUT-PIN
  Top 0.152: R37.2 13.41,16.19 U1.19
N$1
  Bottom 0.152: 18.71,2.47 +.1
  Bottom 0.508: L1.2 18.71,2.47
N$2
  Top 0.254: R43.2 R42.2 | R43.2 2.49,16.87 5.74,16.87 6.08,17.21 R1.1 | R2.1 6.28,15.99 5.39,16.88 2.49,16.88 R43.2
N$3
  Bottom 0.508: R41.2 C15.2
N$4
  Top 0.254: R44.1 5.4,12.58 4.93,13.06 JP4.1
N$7
  Top 0.152: D2.A 28.84,15.74 | 28.84,15.74 29.4,16.31 29.4,18.38 28.85,18.94 D3.A 28.46,19.18 R36.1 | D1.A 28.7,12.66 29.38,13.34 29.38,14.95 28.96,15.36 28.96,15.62 28.84,15.74
OUT
  Top 0.152: R7.1 17.36,9.44 15.99,10.81 U1.10 | C5.2 17.15,7.94 17.15,9.4 R7.1 | R7.1 17.95,9.4 R38.2

### Text on the board
bNames: V1.1 ECG CETI | 9-Mar-2023